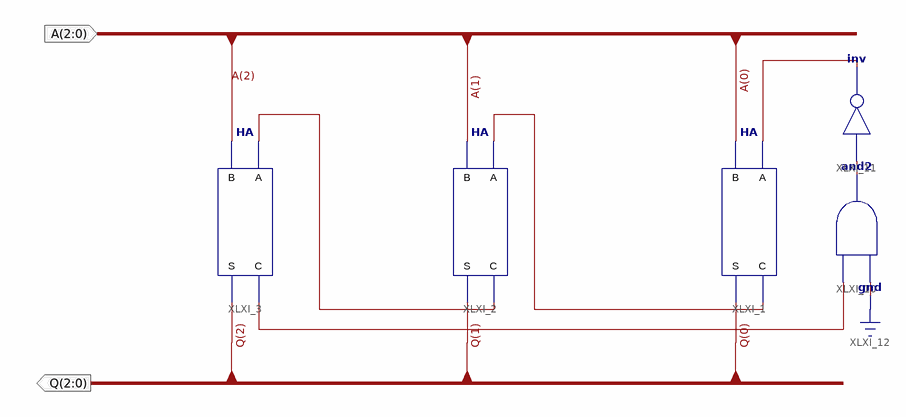
[diagram p0: schematic sheet 1]
// Xilinx ISE schematic Adder_3_Bit.sch (artix7) as structural Verilog: 5 symbols, 2 ports
module Adder_3_Bit (
  input  [2:0] A,
  output [2:0] Q
);

  wire XLXN_18, XLXN_26, XLXN_27, XLXN_35, XLXN_36;

  HA XLXI_1 (.A(XLXN_18), .B(A[0]), .C(XLXN_26), .S(Q[0]));
  HA XLXI_2 (.A(XLXN_26), .B(A[1]), .C(XLXN_27), .S(Q[1]));
  HA XLXI_3 (.A(XLXN_27), .B(A[2]), .C(XLXN_35), .S(Q[2]));
  and XLXI_10 (XLXN_36, 1'b0, XLXN_35);
  not XLXI_11 (XLXN_18, XLXN_36);
endmodule
